# EAGLE design ext_esp_wroom_32-2 (EAGLE 9.6.2)
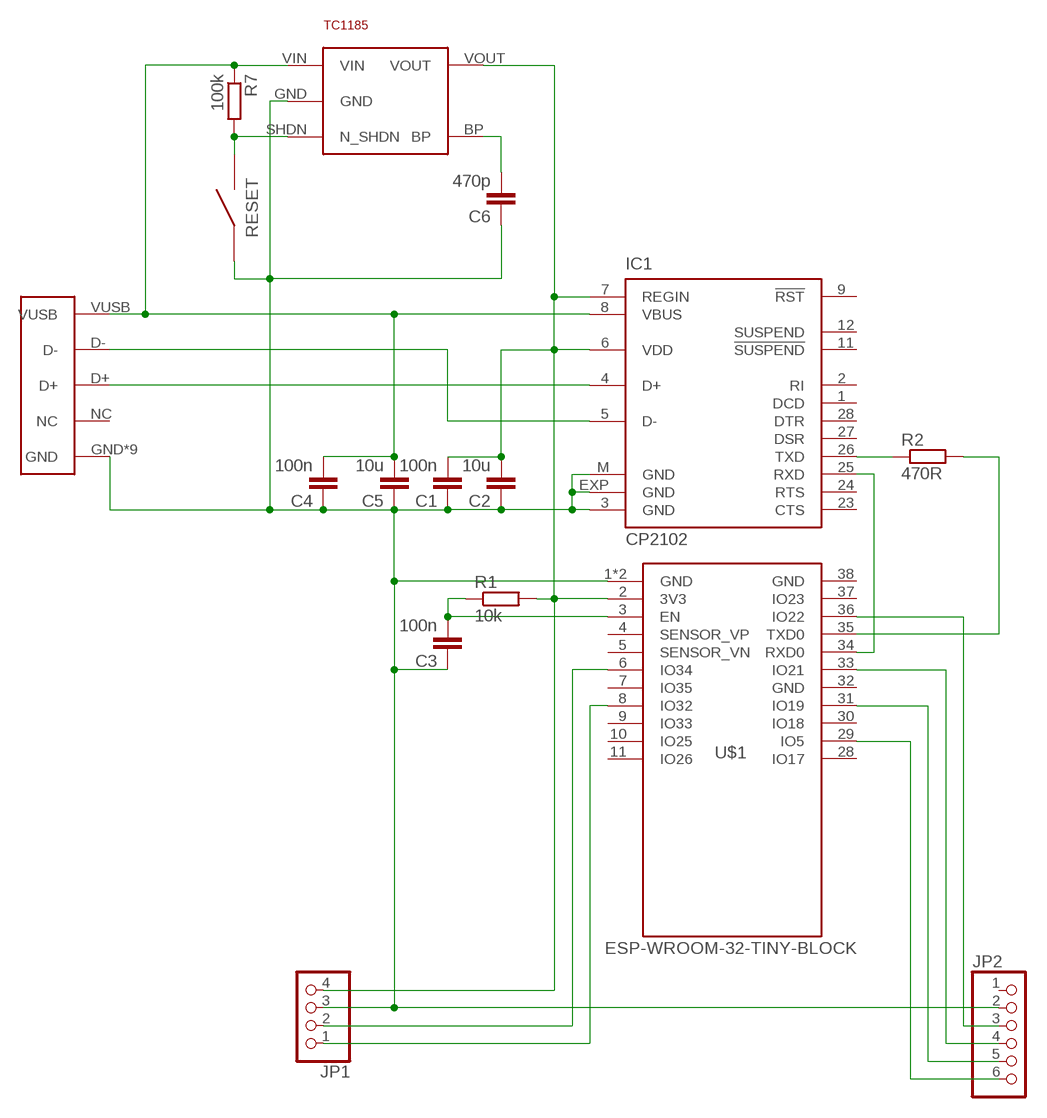
[diagram p0: schematic, sheet 1]

## Parts
C1  100n  C-EUC0805K  [C0805K]
C2  10u  C-EUC0805K  [C0805K]
C3  100n  C-EUC0805K  [C0805K]
C4  100n  C-EUC0805K  [C0805K]
C5  10u  C-EUC0805K  [C0805K]
C6  470p  C-EUC0805K  [C0805K]
IC1  CP2102  [MLP28]
JP1  PINHD-1X4  [1X04]
JP2  PINHD-1X6  [1X06]
R1  10k  R-EU_R0805  [R0805]
R2  470R  R-EU_R0805  [R0805]
R7  100k  R-EU_R0603  [R0603]
RESET  BYTTON-B3U  [BUTTON-B3U]
TC1185  TC1185  STABILISER_APE8865  [SOT32-5]
U$1  ESP-WROOM-32-TINY-BLOCK  [ESP-WROOM-32-TINY-BLOCK]
USB  USBMICRO  [MICROUSB-MOLEX]

## Nets
EN: C3.2 R1.1 U$1.3(EN)
GND: C1.1 C2.1 C3.1 C4.1 C5.1 C6.1 IC1.3(GND) IC1.EXP(GND) IC1.M(GND) JP1.3 JP2.2 RESET.P$1 TC1185.GND U$1.1(GND) U$1.GND USB.GND USB.GND1(GND) USB.GND2(GND) USB.GND3(GND) USB.GND4(GND) USB.P$1(GND) USB.P$2(GND) USB.P$3(GND) USB.P$6(GND)
N$1: IC1.5(D-) USB.D-
N$2: IC1.4(D+) USB.D+
N$4: IC1.26(TXD) R2.1
N$5: R2.2 U$1.35(TXD0)
N$6: IC1.25(RXD) U$1.34(RXD0)
N$7: C6.2 TC1185.BP
N$12: C4.2 C5.2 IC1.8(VBUS) R7.1 TC1185.VIN USB.VUSB
N$20: R7.2 RESET.P$2 TC1185.SHDN(N_SHDN)
P0: JP1.2 U$1.6(IO34)
P1: JP1.1 U$1.8(IO32)
P4: JP2.3 U$1.36(IO22)
SCL: JP2.5 U$1.31(IO19)
SDA: JP2.6 U$1.29(IO5)
UPDI: JP2.4 U$1.33(IO21)
VCC: C1.2 C2.2 IC1.6(VDD) IC1.7(REGIN) JP1.4 R1.2 TC1185.VOUT U$1.2(3V3)
Unconnected: IC1.1(DCD) IC1.2(RI) IC1.9(!RST) IC1.11(!SUSPEND) IC1.12(SUSPEND) IC1.23(CTS) IC1.24(RTS) IC1.27(DSR) IC1.28(DTR) JP2.1 U$1.4(SENSOR_VP) U$1.5(SENSOR_VN) U$1.7(IO35) U$1.9(IO33) U$1.10(IO25) U$1.11(IO26) U$1.28(IO17) U$1.30(IO18) U$1.37(IO23) USB.NC

## Power pins joined to a net without a drawn wire
GND: U$1.32(GND) U$1.38(GND)

## Library data of the parts
C1-C6 = rcl:C-EU: CAPACITOR, European symbol; SPICEPREFIX: C
IC1 = silabs:CP210*: Single-Chip USB to UART Bridge Source: www.silabs.com .. CP2101.pdf / cp2102.pdf; MF: FARNELL; MPN: CP2102-GM; OC_FARNELL: 9282130; OC_NEWARK: 30K5635
JP1 = pinhead2:PINHD-1X4: PIN HEADER
JP2 = pinhead2:PINHD-1X6: PIN HEADER
R1 R2 = rcl:R-EU_: RESISTOR, European symbol; SPICEPREFIX: R
R7 = resistor:R-EU_: RESISTOR, European symbol
RESET = !stavebnice03:BYTTON-B3U
TC1185 = !stavebnice03:STABILISER_APE8865
U$1 = esp32:ESP-WROOM-32-TINY-BLOCK
USB = !stavebnice03:USBMICRO

## Board
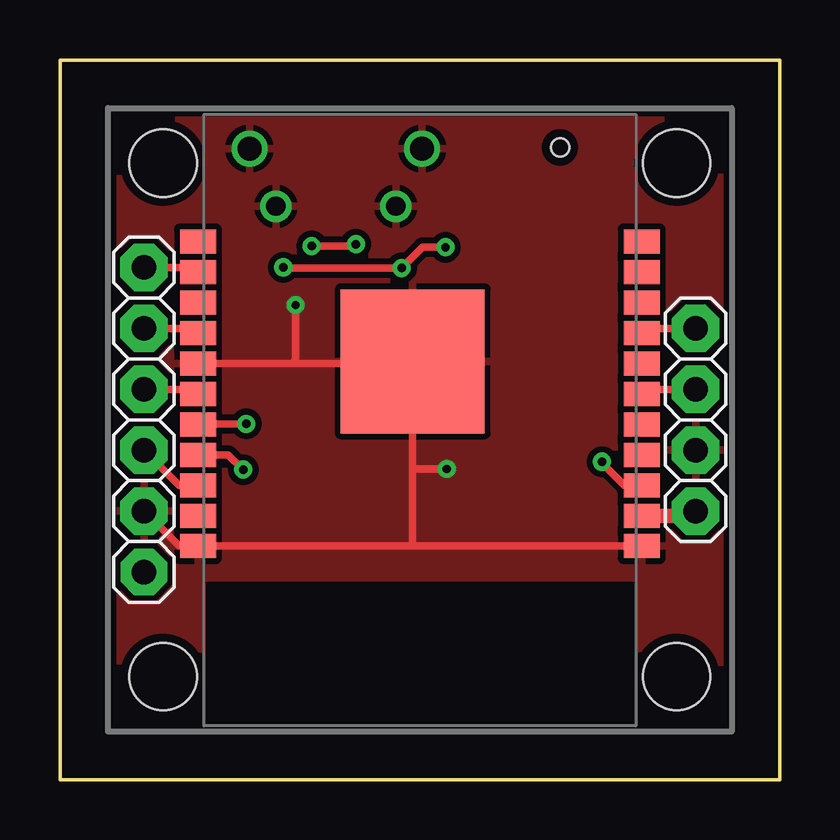
[diagram p1: board, top side]
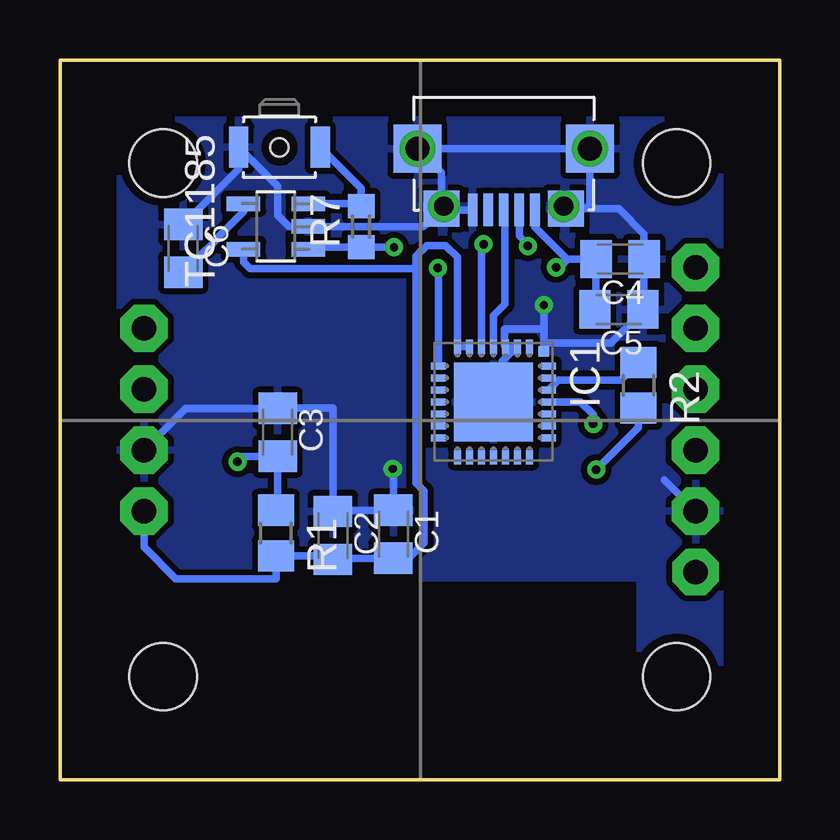
[diagram p2: board, bottom side, seen from below]

Size 30 x 30 mm. Coordinates in mm from the lower left corner, seen from the top.
Outline: 0,0 0,30 30,30 30,0 0,0
Copper layers (1*16): Top 0.035mm / dielectric 1.5mm / Bottom 0.035mm
Design rules "default *": minimum track width 12mil, minimum drill 0.35mm, track to track 10mil, track to pad 10mil, pad to pad 10mil, via to via 10mil, smd to smd 10mil, copper to edge 15mil, drill to drill 15mil, minimum pad ring 10mil, minimum via ring 8mil, stop-mask expansion 4mil, vias tented up to drill 0mil, thermal gap 10mil
Holes 2.8 mm at 4.3,4.3 25.7,25.7 25.7,4.3 4.3,25.7

### Footprints (pad centres in the part's own frame; a part is rotated, then mirrored left to right if it is on the bottom)
C0805K = smd 1.3 x 1.6: 1 -1,0; 2 1,0
MLP28 = smd 0.6 x 0.3: 1 -2.3,1.5; 2 -2.3,1; 3 -2.3,0.5; 4 -2.3,0; 5 -2.3,-0.5; 6 -2.3,-1; 7 -2.3,-1.5; 15 2.3,-1.5; 16 2.3,-1; 17 2.3,-0.5; 18 2.3,0; 19 2.3,0.5; 20 2.3,1; 21 2.3,1.5 | smd 0.3 x 0.6: 8 -1.5,-2.3; 9 -1,-2.3; 10 -0.5,-2.3; 11 0,-2.3; 12 0.5,-2.3; 13 1,-2.3; 14 1.5,-2.3; 22 1.5,2.3; 23 1,2.3; 24 0.5,2.3; 25 0,2.3; 26 -0.5,2.3; 27 -1,2.3; 28 -1.5,2.3 | smd 3.3 x 3.3: EXP 0,0 | smd 0.435 x 0.435: M -2.103,2.103
1X04 = drill 1.016 pad 1.981 octagon: 1 -3.81,0; 2 -1.27,0; 3 1.27,0; 4 3.81,0
1X06 = drill 1.016 pad 1.93 octagon: 1 -6.35,0 | drill 1.016 pad 1.981 octagon: 2 -3.81,0; 3 -1.27,0; 4 1.27,0; 5 3.81,0; 6 6.35,0
R0805 = smd 1.3 x 1.5: 1 -0.95,0; 2 0.95,0
R0603 = smd 1 x 1.1: 1 -0.85,0; 2 0.85,0
BUTTON-B3U = smd 0.8 x 1.7: P$1 -1.7,0; P$2 1.7,0 | hole 0.75: 0,0
SOT32-5 = smd 0.6 x 1.4: BP 0.95,1.35; GND 0,-1.35; SHDN 0.95,-1.35; VIN -0.95,-1.35; VOUT -0.95,1.35
ESP-WROOM-32-TINY-BLOCK = smd 1.5 x 1: 1 -9.25,8.27; 2 -9.25,7; 3 -9.25,5.73; 4 -9.25,4.46; 5 -9.25,3.19; 6 -9.25,1.92; 7 -9.25,0.65; 8 -9.25,-0.62; 9 -9.25,-1.89; 10 -9.25,-3.16; 11 -9.25,-4.43; 28 9.25,-4.43; 29 9.25,-3.16; 30 9.25,-1.89; 31 9.25,-0.62; 32 9.25,0.65; 33 9.25,1.92; 34 9.25,3.19; 35 9.25,4.46; 36 9.25,5.73; 37 9.25,7; 38 9.25,8.27 | smd 6 x 6: GND 0.3,0.57
MICROUSB-MOLEX = smd 0.4 x 1.35: D+ 0,2.35; D- -0.65,2.35; GND 1.3,2.35; NC 0.65,2.35; VUSB -1.3,2.35 | smd 2 x 2: GND1 -3.6,-0.2; GND2 3.6,-0.2 | smd 1.5 x 1.5: GND3 -2.59,2.3; GND4 2.6,2.3 | drill 1: P$1 -3.6,-0.2; P$2 3.6,-0.2 | drill 0.8: P$3 -2.5,2.2; P$6 2.5,2.2

### Placement (x,y rotation side)
C1  16.1,10.23 270 bottom
C2  18.62,10.17 270 bottom
C3  20.92,14.48 270 bottom
C4  6.65,21.7 180 bottom
C5  6.7,19.6 180 bottom
C6  24.86,22.14 270 bottom
IC1  11.93,15.74 270 bottom
JP1  26.5,15 270 top
JP2  3.5,15 90 top
R1  21,10.28 270 bottom
R2  5.88,16.44 270 bottom
R7  17.44,23.06 90 bottom
RESET  20.85,26.36 0 bottom
TC1185  21,23.06 90 bottom
U$1  15,18 180 top
USB  11.5,26.1 180 bottom

### Tracks (layer width: path | path; a pad name or v marks a point on that pad's centre or on a via)
EN  (via drill 0.35)
  Top 0.305: U$1.3 23.53,12.27 22.6,13.2 v22.6,13.25
  Bottom 0.305: R1.1 20.92,11.3 C3.2 22.37,13.48 v22.6,13.25
GND  (via drill 0.35)
  Top 0.305: U$1.32 9.67,17.35 | 9.67,17.35 14.7,17.35 | 14.7,9.73 U$1.38 4.96,9.73 JP2.2 | 14.7,17.35 14.7,12.9 | 14.7,12.9 14.7,9.73 | 14.7,9.73 U$1.1 | U$1.GND 14.7,17.35 | v16.12,12.95 14.75,12.95 14.7,12.9 | v9.82,19.78 9.82,17.5 9.67,17.35
  Bottom 0.305: JP1.3 24.75,15.48 C3.1 20.9,15.5 18.62,15.5 C2.1 18.57,11.22 C1.1 16.1,12.93 v16.12,12.95 | JP2.2 4.8,12.49 | USB.GND3 8.89,23.82 8,23.82 7.9,23.91 USB.GND1 USB.P$2 14.1,25.3 USB.GND4 | USB.GND3 6.7,23.8 5.65,22.75 C4.1 5.65,19.65 C5.1 5.7,19.54 7.03,18.2 9.82,18.2 | USB.GND 13.68,23.75 | 13.68,23.75 13.85,23.75 USB.P$6 | USB.GND3 USB.P$3 | C6.1 22.55,25.45 RESET.P$1 20.92,24.73 20.92,23.54 20.44,23.06 TC1185.GND 14.84,23.06 USB.GND4 | 9.87,17.89 IC1.M 9.82,18.2 | 9.82,18.79 11.47,18.79 11.47,18.09 IC1.3 11.26,18.04 11.2,17.98 11.2,17.8 11.58,17.42 11.58,16.09 IC1.EXP | 9.82,18.79 9.82,18.2 | USB.GND4 13.73,23.8 13.68,23.75 | 9.82,18.79 v9.82,19.78
  pour Top: 2.5,27.5 27.5,27.5 27.5,2.5 2.5,2.5
  pour Bottom: 2.5,27.5 27.5,27.5 27.5,2.5 2.5,2.5
N$1  (via drill 0.35)
  Top 0.305: v12.34,22.32 12.26,22.25 v10.5,22.25
  Bottom 0.305: v12.34,22.32 12.43,22.23 IC1.5 | USB.D- 10.85,22.68 v10.5,22.25
N$2
  Bottom 0.305: IC1.4 11.93,19.35 11.45,19.83 11.45,22.9 11.46,22.91 11.46,23.71 USB.D+
N$4
  Bottom 0.305: IC1.26 9.22,16.65 6.61,16.65 R2.1
N$5  (via drill 0.35)
  Top 0.305: U$1.35 7.02,13.54 v7.64,12.92
  Bottom 0.305: v7.64,12.92 5.88,14.68 R2.2
N$6  (via drill 0.35)
  Top 0.305: v7.77,14.83 5.77,14.83 U$1.34
  Bottom 0.305: IC1.25 8.3,15.74 7.77,15.21 v7.77,14.83
N$7
  Bottom 0.305: C6.2 23.92,22.09 23.89,22.09 23.46,22.52 23.46,22.57 22.35,23.68 TC1185.BP
N$12  (via drill 0.35)
  Top 0.305: v16.07,22.19 15.11,22.19 v14.24,21.33 9.34,21.33 v9.32,21.36
  Bottom 0.305: USB.VUSB 10.2,23.03 8.87,21.7 | 8.87,21.7 8.84,21.67 8.99,21.53 9.12,21.55 v9.32,21.36 | 8.87,21.7 C4.2 7.65,19.65 C5.2 | TC1185.VIN 19.55,22.21 R7.1 16.09,22.21 v16.07,22.19 | IC1.8 14.23,21.31 v14.24,21.33
N$20
  Bottom 0.305: RESET.P$2 17.44,24.66 17.44,23.97 | 17.44,23.97 R7.2 | TC1185.SHDN 17.48,24.01 17.44,23.97
P0
  Top 0.305: JP1.2 24.44,16.27 U$1.6
P1
  Top 0.305: JP1.1 24.44,18.81 U$1.8
P4
  Top 0.305: U$1.36 4.96,12.27 JP2.3
SCL
  Top 0.305: JP2.5 5.75,18.81 U$1.31
SDA
  Top 0.305: JP2.6 5.75,21.35 U$1.29
UPDI
  Top 0.305: JP2.4 5.75,16.27 U$1.33
VCC
  Top 0.305: 24.44,11.19 U$1.2
  Top 0.61: U$1.2 26.31,11 JP1.4
  Bottom 0.305: 26.24,11.45 JP1.4 26.5,9.69 25.18,8.37 21,8.37 R1.2 18.77,9.33 C2.2 18.57,9.22 C1.2 15.48,9.22 14.83,9.87 14.83,12.04 15.15,12.37 15.15,21.3 | IC1.6 IC1.7 13.43,21.78 13.92,22.27 14.7,22.27 15.15,21.82 15.15,21.3 | TC1185.VOUT 22.35,21.57 22.08,21.3 15.15,21.3

### Text on the board
bDocu: GND | GND | VCC | VCC